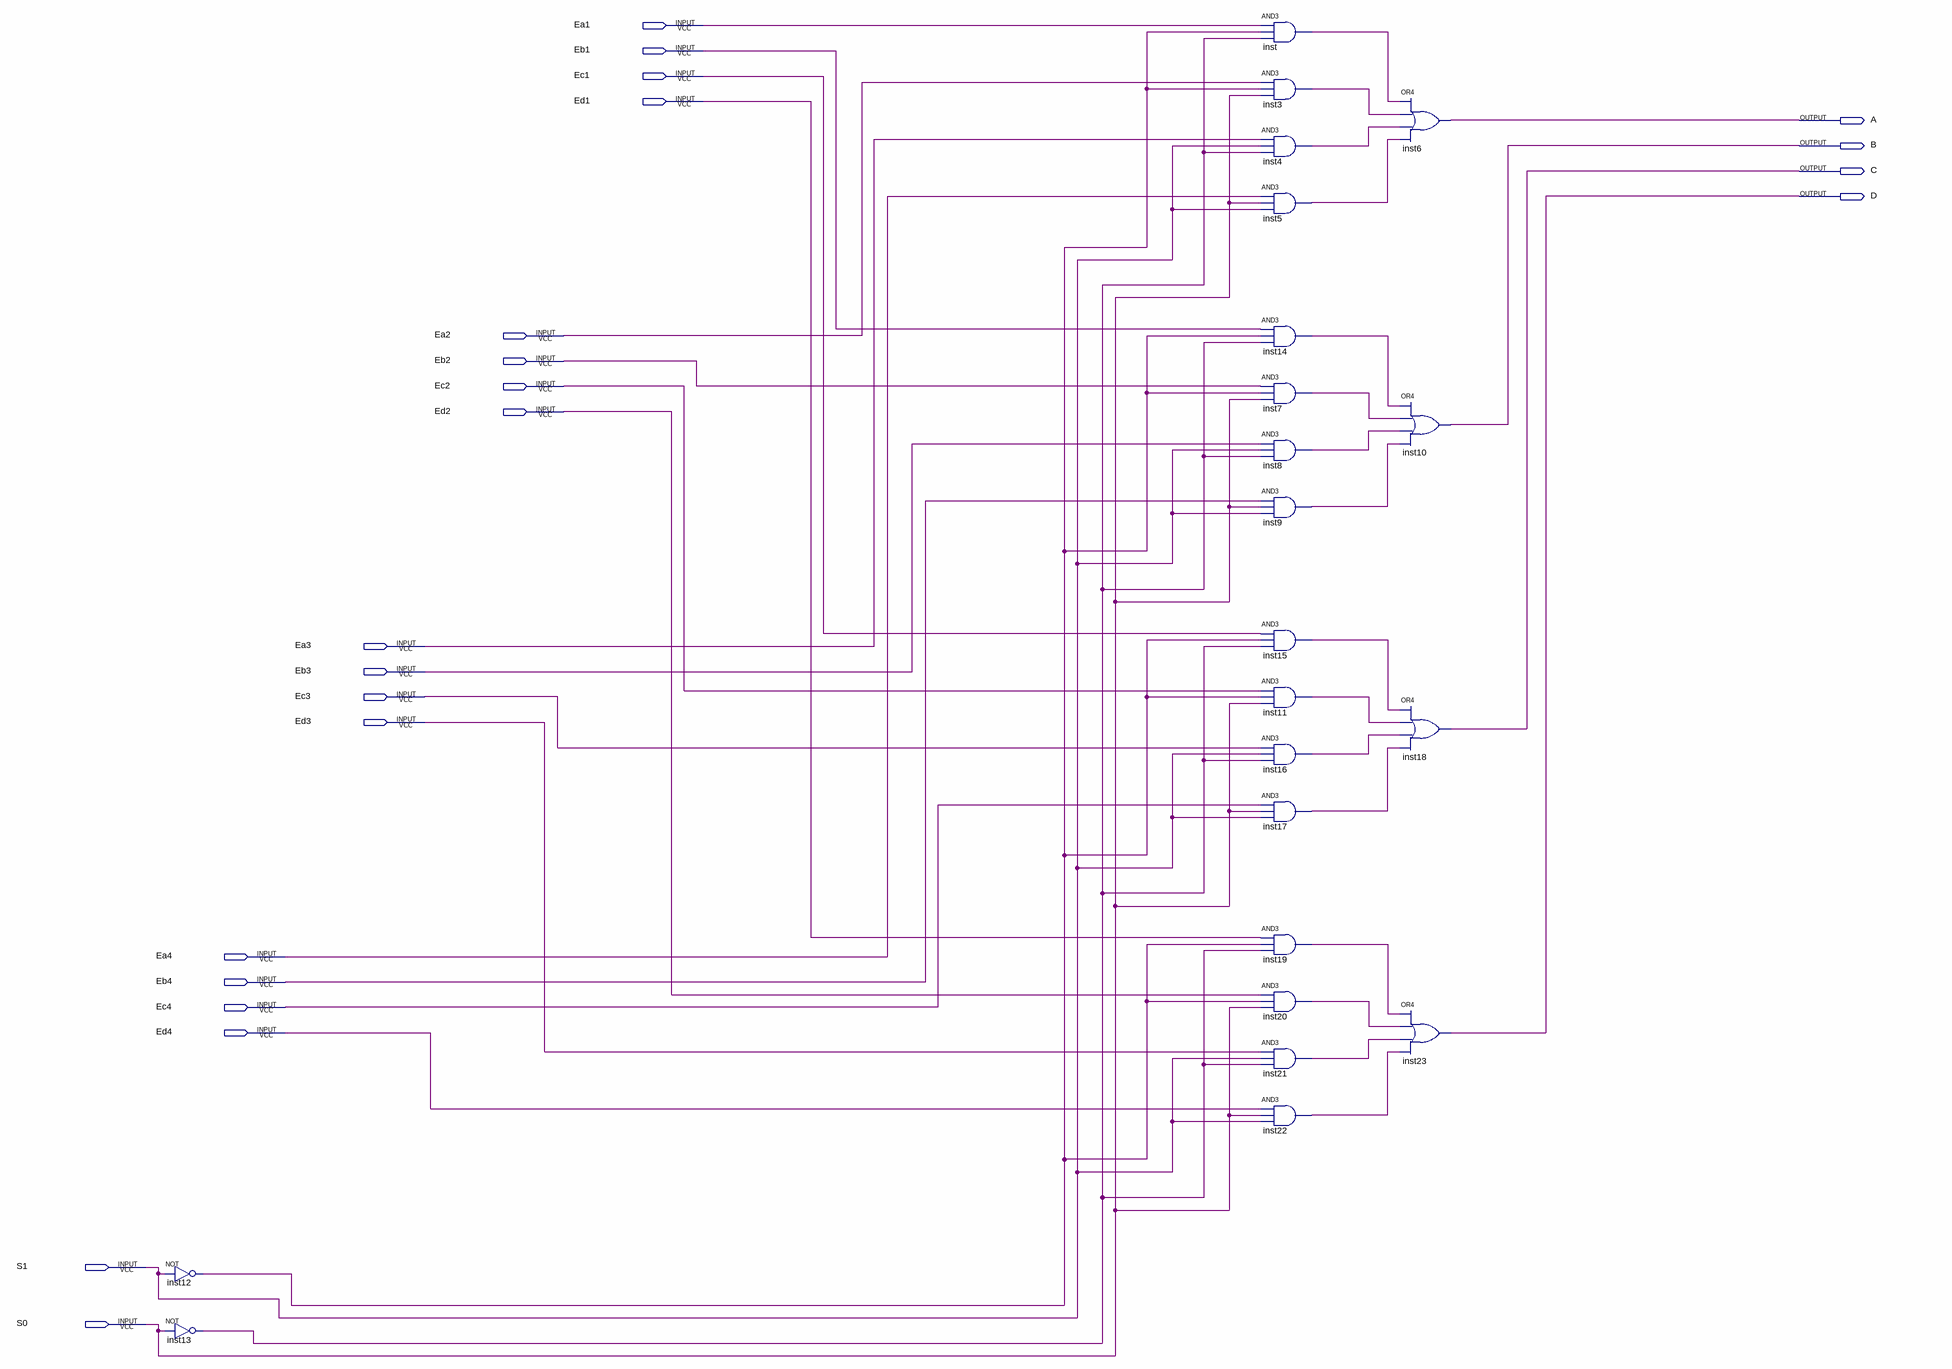
[diagram p0: schematic sheet]
// Quartus schematic multiplexador.bdf as structural Verilog: 22 symbols, 22 pins
module multiplexador (
  input  Ea1,
  input  Eb1,
  input  Ec1,
  input  Ed1,
  input  Ea2,
  input  Eb2,
  input  Ec2,
  input  Ed2,
  input  Ea3,
  input  Eb3,
  input  Ec3,
  input  Ed3,
  input  Ea4,
  input  Eb4,
  input  Ec4,
  input  Ed4,
  input  S1,
  input  S0,
  output A,
  output B,
  output C,
  output D
);

  wire inst3_out, inst4_out, inst5_out, inst7_out, inst8_out, inst9_out, inst11_out, inst12_out, inst13_out,
       inst14_out, inst15_out, inst16_out, inst17_out, inst19_out, inst20_out, inst21_out, inst22_out,
       inst_out;

  not inst12 (inst12_out, S1);
  not inst13 (inst13_out, S0);
  and inst (inst_out, Ea1, inst12_out, inst13_out);
  and inst3 (inst3_out, Ea2, inst12_out, S0);
  and inst4 (inst4_out, Ea3, S1, inst13_out);
  and inst5 (inst5_out, Ea4, S0, S1);
  and inst14 (inst14_out, Eb1, inst12_out, inst13_out);
  and inst7 (inst7_out, Eb2, inst12_out, S0);
  and inst8 (inst8_out, Eb3, S1, inst13_out);
  and inst9 (inst9_out, Eb4, S0, S1);
  and inst15 (inst15_out, Ec1, inst12_out, inst13_out);
  and inst11 (inst11_out, Ec2, inst12_out, S0);
  and inst16 (inst16_out, Ec3, S1, inst13_out);
  and inst17 (inst17_out, Ec4, S0, S1);
  and inst19 (inst19_out, Ed1, inst12_out, inst13_out);
  and inst20 (inst20_out, Ed2, inst12_out, S0);
  and inst21 (inst21_out, Ed3, S1, inst13_out);
  and inst22 (inst22_out, Ed4, S0, S1);
  or inst6 (A, inst_out, inst3_out, inst4_out, inst5_out);
  or inst10 (B, inst14_out, inst7_out, inst8_out, inst9_out);
  or inst18 (C, inst15_out, inst11_out, inst16_out, inst17_out);
  or inst23 (D, inst19_out, inst20_out, inst21_out, inst22_out);
endmodule
